# Altium schematic sheet PS_GTR.SchDoc
size A3
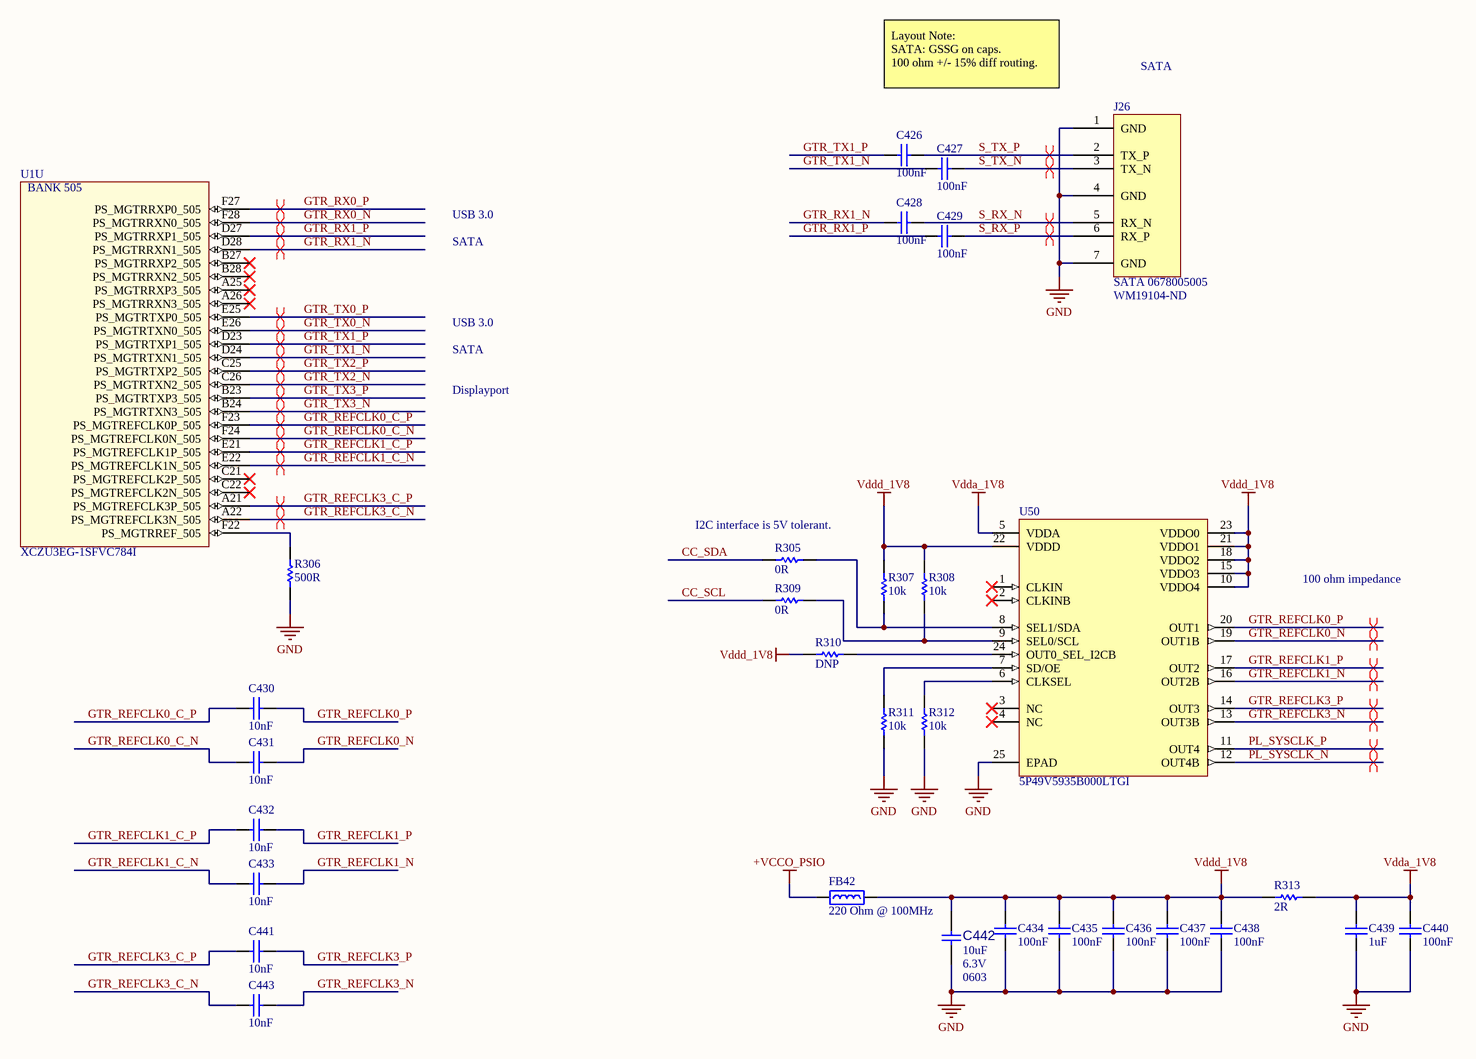
[diagram p0: PS_GTR.SchDoc]

## Parts
C426  100nF  [CAPC1005L_0402]
C427  100nF  [CAPC1005L_0402]
C428  100nF  [CAPC1005L_0402]
C429  100nF  [CAPC1005L_0402]
C430  10nF  [CAPC1005L_0402]
C431  10nF  [CAPC1005L_0402]
C432  10nF  [CAPC1005L_0402]
C433  10nF  [CAPC1005L_0402]
C434  100nF  [CAPC1005L_0402]
C435  100nF  [CAPC1005L_0402]
C436  100nF  [CAPC1005L_0402]
C437  100nF  [CAPC1005L_0402]
C438  100nF  [CAPC1005L_0402]
C439  1uF  [CAPC1005L_0402]
C440  100nF  [CAPC1005L_0402]
C441  10nF  [CAPC1005L_0402]
C442  value 10uF  Voltage: 6.3V  Package: 0603  [CAP_C_0603]  (hidden comment: Capacitor NP)
C443  10nF  [CAPC1005L_0402]
FB42  Impedance @ Frequency: 220 Ohm @ 100MHz  [INDC1608N_0603]  (hidden comment: BEAD0603_220_2A5_40M)
J26  SATA 0678005005  Supplier Part Number 1: WM19104-ND  [SATA HEADER]
R305  value 0R  [RESC1005L_0402]  (hidden comment: RES0402_0R_0W1)
R306  value 500R  [RESC1005L_0402]  (hidden comment: RES0402_500R_0W05_01T)
R307  value 10k  [RESC1005L_0402]  (hidden comment: RES0402_10K_0W1_05T)
R308  value 10k  [RESC1005L_0402]  (hidden comment: RES0402_10K_0W1_05T)
R309  value 0R  [RESC1005L_0402]  (hidden comment: RES0402_0R_0W1)
R310  value DNP  [RESC1005L_0402]  (hidden comment: RES0402)
R311  value 10k  [RESC1005L_0402]  (hidden comment: RES0402_10K_0W1_05T)
R312  value 10k  [RESC1005L_0402]  (hidden comment: RES0402_10K_0W1_05T)
R313  value 2R  [RESC1005L_0402]  (hidden comment: RES0402_2R_0W1_1T)
U1  XCZU3EG-1SFVC784I  [BGA784x28]  (part U of 22)
U50  5P49V5935B000LTGI  [LGA24_5P49V5935B000LTGI]

## Nets
+VCCO_PSIO: FB42.1
GND: C434.1 C435.1 C436.1 C437.1 C438.1 C439.1 C440.1 C442.1 J26.1(GND) J26.4(GND) J26.7(GND) R306.1 R311.1 R312.1 U50.25(EPAD)
Vdda_1V8: C439.2 C440.2 R313.2 U50.5(VDDA)
Vddd_1V8: C434.2 C435.2 C436.2 C437.2 C438.2 C442.2 FB42.2 R307.2 R308.2 R310.1 R313.1 U50.10(VDDO4) U50.15(VDDO3) U50.18(VDDO2) U50.21(VDDO1) U50.22(VDDD) U50.23(VDDO0)
CC_SCL: R309.1
CC_SDA: R305.1
GTR_REFCLK0_C_N: C431.1 U1.F24(PS_MGTREFCLK0N_505)
GTR_REFCLK0_C_P: C430.1 U1.F23(PS_MGTREFCLK0P_505)
GTR_REFCLK0_N: C431.2 U50.19(OUT1B)
GTR_REFCLK0_P: C430.2 U50.20(OUT1)
GTR_REFCLK1_C_N: C433.1 U1.E22(PS_MGTREFCLK1N_505)
GTR_REFCLK1_C_P: C432.1 U1.E21(PS_MGTREFCLK1P_505)
GTR_REFCLK1_N: C433.2 U50.16(OUT2B)
GTR_REFCLK1_P: C432.2 U50.17(OUT2)
GTR_REFCLK3_C_N: C443.1 U1.A22(PS_MGTREFCLK3N_505)
GTR_REFCLK3_C_P: C441.1 U1.A21(PS_MGTREFCLK3P_505)
GTR_REFCLK3_N: C443.2 U50.13(OUT3B)
GTR_REFCLK3_P: C441.2 U50.14(OUT3)
GTR_RX0_N: U1.F28(PS_MGTRRXN0_505)
GTR_RX0_P: U1.F27(PS_MGTRRXP0_505)
GTR_RX1_N: C428.1 U1.D28(PS_MGTRRXN1_505)
GTR_RX1_P: C429.1 U1.D27(PS_MGTRRXP1_505)
GTR_TX0_N: U1.E26(PS_MGTRTXN0_505)
GTR_TX0_P: U1.E25(PS_MGTRTXP0_505)
GTR_TX1_N: C427.1 U1.D24(PS_MGTRTXN1_505)
GTR_TX1_P: C426.1 U1.D23(PS_MGTRTXP1_505)
GTR_TX2_N: U1.C26(PS_MGTRTXN2_505)
GTR_TX2_P: U1.C25(PS_MGTRTXP2_505)
GTR_TX3_N: U1.B24(PS_MGTRTXN3_505)
GTR_TX3_P: U1.B23(PS_MGTRTXP3_505)
PL_SYSCLK_N: U50.12(OUT4B)
PL_SYSCLK_P: U50.11(OUT4)
S_RX_N: C428.2 J26.5(RX_N)
S_RX_P: C429.2 J26.6(RX_P)
S_TX_N: C427.2 J26.3(TX_N)
S_TX_P: C426.2 J26.2(TX_P)
NetR305_2: R305.2 R307.1 U50.8(SEL1/SDA)
NetR306_2: R306.2 U1.F22(PS_MGTRREF_505)
NetR308_1: R308.1 R309.2 U50.9(SEL0/SCL)
NetR310_2: R310.2 U50.24(OUT0_SEL_I2CB)
NetR311_2: R311.2 U50.7(SD/OE)
NetR312_2: R312.2 U50.6(CLKSEL)

Not connected (* = marked no-connect by the designer): U1 A25(PS_MGTRRXP3_505)* A26(PS_MGTRRXN3_505)* B27(PS_MGTRRXP2_505)* B28(PS_MGTRRXN2_505)* C21(PS_MGTREFCLK2P_505)* C22(PS_MGTREFCLK2N_505)*; U50 1(CLKIN)* 2(CLKINB)* 3(NC)* 4(NC)*

## Layout directives
differential pair: GTR_REFCLK0_C_N, GTR_REFCLK0_C_P, GTR_REFCLK0_N, GTR_REFCLK0_P, GTR_REFCLK1_C_N, GTR_REFCLK1_C_P, GTR_REFCLK1_N, GTR_REFCLK1_P, GTR_REFCLK3_C_N, GTR_REFCLK3_C_P, GTR_REFCLK3_N, GTR_REFCLK3_P, GTR_RX0_N, GTR_RX0_P, GTR_RX1_N, GTR_RX1_P, GTR_TX0_N, GTR_TX0_P, GTR_TX1_N, GTR_TX1_P, GTR_TX2_N, GTR_TX2_P, GTR_TX3_N, GTR_TX3_P, PL_SYSCLK_N, PL_SYSCLK_P, S_RX_N, S_RX_P, S_TX_N, S_TX_P

## Notes on the sheet
- Layout Note:
  SATA: GSSG on caps.
  100 ohm +/- 15% diff routing.
- SATA
- USB 3.0
- Displayport
- I2C interface is 5V tolerant.
- 100 ohm impedance
- (in symbol XCZU3EG-1SFVC784I, part U) BANK 505

## Library data of the parts
C426-C429 C434-C438 C440 = CAPCER0402X7R100N25V_10T: CAP CER 0.1UF 25V X7R 0402; Manufacturer 1: Murata Electronics North America; Manufacturer Part Number 1: GRM155R71E104KE14D; Tolerance: 10%; Package: 0402; ComponentLink1Description: Datasheet; Value: 100nF; Voltage: 25V; Temperature Coefficient: X7R; Supplier 1: Digi-Key; Supplier Part Number 1: 490-10698-1-ND; Operating Temperature: -55°C ~ 125°C
C430-C433 C441 C443 = CAPCER0402X7R10N50V_10T: CAP CER 10000PF (10NF) 50V X7R 0402; Manufacturer 1: Murata Electronics North America; Manufacturer Part Number 1: GRM155R71H103KA88D; Tolerance: 10%; Package: 0402; ComponentLink1Description: Datasheet; Value: 10nF; Voltage: 50V; Temperature Coefficient: X7R; Supplier 1: Digi-Key; Supplier Part Number 1: 490-4516-1-ND; Operating Temperature: -55°C ~ 125°C
C439 = CAPCER0402X5R1U16V_20T: CAP CER 1UF 16V X5R 0402; Manufacturer 1: Murata Electronics North America; Manufacturer Part Number 1: GRM155R61C105ME01D; Tolerance: 20%; Package: 0402; ComponentLink1Description: Datasheet; Value: 1uF; Voltage: 16V; Temperature Coefficient: X5R; Supplier 1: Digi-Key; Supplier Part Number 1: 490-10454-1-ND; Operating Temperature: -55°C ~ 85°C
C442 = CAP0533: Capacitor; Manufacturer 1: AVX; Manufacturer Part Number 1: 06036D106MAT2A; Description_: CAP CER 10uF 6.3V 20% X5R SMD 0603; Dev Tools Status: Production; Tolerance: 20%; Temperature Coeffcient: X5R; Type: Ceramic; Populated: Yes; MCHP-ID: CAP0533; Revision: 1; Status: MCL Design; ComponentLink1URL: https://chn-vm-apps.microchip.com/mchprepo/parts/Datasheets/smccp.pdf; ComponentLink1Description: Datasheet; Operating Temperature: -55C to +85C; Category: Capacitor; Manufacturer 2: KEMET; Manufacturer Part Number 2: C0603C106M9PACTU; Manufacturer 3: Murata; Manufacturer Part Number 3: GRM188R60J106ME47D; Manufacturer 4: TDK Corporation; Manufacturer Part Number 4: C1608X5R0J106M080AB; Manufacturer 5: TDK Corporation; Manufacturer Part Number 5: C1608X5R0J106M; Supplier 1: Digi-Key; Supplier Part Number 1: 478-5318-2-ND; Supplier 2: Digi-Key; Supplier Part Number 2: 399-5504-1-ND; Supplier 3: Digi-Key; Supplier Part Number 3: 490-3896-2-ND; Supplier 4: Digi-Key; Supplier Part Number 4: 445-4112-1-ND; Quantity Override: 1
FB42 = BEAD0603_220_2A5_40M: FERRITE BEAD 220 OHM 0603 1LN; Manufacturer 1: Murata Electronics North America; Manufacturer Part Number 1: BLM18SG221TN1D; Current Rating (Max): 2.5A; DC Resistance (DCR) (Max): 40 mohm; Package: 0603; ComponentLink1Description: Datasheet; ComponentLink1URL: C:\Users\Public\Documents\Altium\AD16\Library\PDF\ENFA0003.pdf; Supplier 1: Digi-Key; Supplier Part Number 1: 490-5225-1-ND; Operating Temperature: -55°C ~ 125°C
J26 = SATA 0678005005: CONN HEADER 7POS VERT SMD 15GOLD; Manufacturer: Molex, LLC; Connector Style: Header, Shrouded; Number of Positions: 7; Digi-Key Part Number: WM19104-ND; Manufacturer Part Number: 0678005005; Series: 67800; Part Status: Active; Connector Type: SATA; Mounting Type: Surface Mount; Termination: Solder; Features: Board Guide; Contact Finish: Gold; Contact Finish Thickness: 15µin (0.38µm); Supplier 1: Digi-Key
R305 R309 = RES0402_0R_0W1: RES SMD 0 OHM JUMPER 1/10W 0402; Manufacturer 1: Panasonic Electronic Components; Manufacturer Part Number 1: ERJ-2GE0R00X; Package: 0402; ComponentLink1Description: Datasheet; Power: 1/10W; Tolerance: -; Supplier 1: Digi-Key; Supplier Part Number 1: P0.0JCT-ND
R306 = RES0402_500R_0W05_01T: RES SMD 500 OHM 0.1% 1/20W 0402; Manufacturer 1: Vishay Dale; Manufacturer Part Number 1: PNM0402E5000BST1; Power: 1/10W; Package: 0402; ComponentLink1Description: Datasheet; Tolerance: 0.1%; Supplier 1: Digi-Key; Supplier Part Number 1: 541-1905-1-ND
R307 R308 R311 R312 = RES0402_10K_0W1_05T: RES SMD 10K OHM 0.5% 1/16W 0402; Manufacturer 1: Panasonic Electronic Components; Manufacturer Part Number 1: ERJ-2RHD1002X; Package: 0402; ComponentLink1Description: Datasheet; Power: 1/16W; Tolerance: 0.5%; Supplier 1: Digi-Key; Supplier Part Number 1: P15984CT-ND
R310 = RES0402: RES SMD 0402 Footprint; Package: 0402; ComponentLink1Description: Datasheet; Tolerance: -
R313 = RES0402_2R_0W1_1T: RES SMD 2 OHM 1% 1/16W 0402; Manufacturer 1: Vishay Dale; Manufacturer Part Number 1: CRCW04022R00FKED; Power: 1/10W; Package: 0402; ComponentLink1Description: Datasheet; Tolerance: 1%; Supplier 1: Digi-Key; Supplier Part Number 1: 541-2.00LLCT-ND
U1 = XCZU3EG-1SFVC784I: IC FPGA 252 I/O 784FCBGA - XILINX ZYNQ ULTRASCALE+; Manufacturer 1: Xilinx Inc.; Package: SFVC784; ComponentLink1Description: Datasheet; Supplier 1: Digi-Key; Supplier Part Number 1: XCZU3EG-1SFVC784I-ND; Manufacturer Part Number 1: XCZU3EG-1SFVC784I
U50 = 5P49V5935B000LTGI: IC CLOCK GENERATOR 24LGA; Manufacturer 1: IDT, Integrated Device Technology Inc; ComponentLink1Description: Datasheet; ComponentLink1URL: C:\Users\Public\Documents\Altium\AD16\Library\PDF\IDT_5P49V5935_DST_20171101.pdf; Supplier 1: Digi-Key; Supplier Part Number 1: 800-3409-ND; Manufacturer Part Number 1: 5P49V5935B000LTGI; Operating Temperature: -40°C ~ 85°C